# EasyEDA Pro project Twinverter_PB_MTE_3.eprj, schematic PL200_Signals_sch
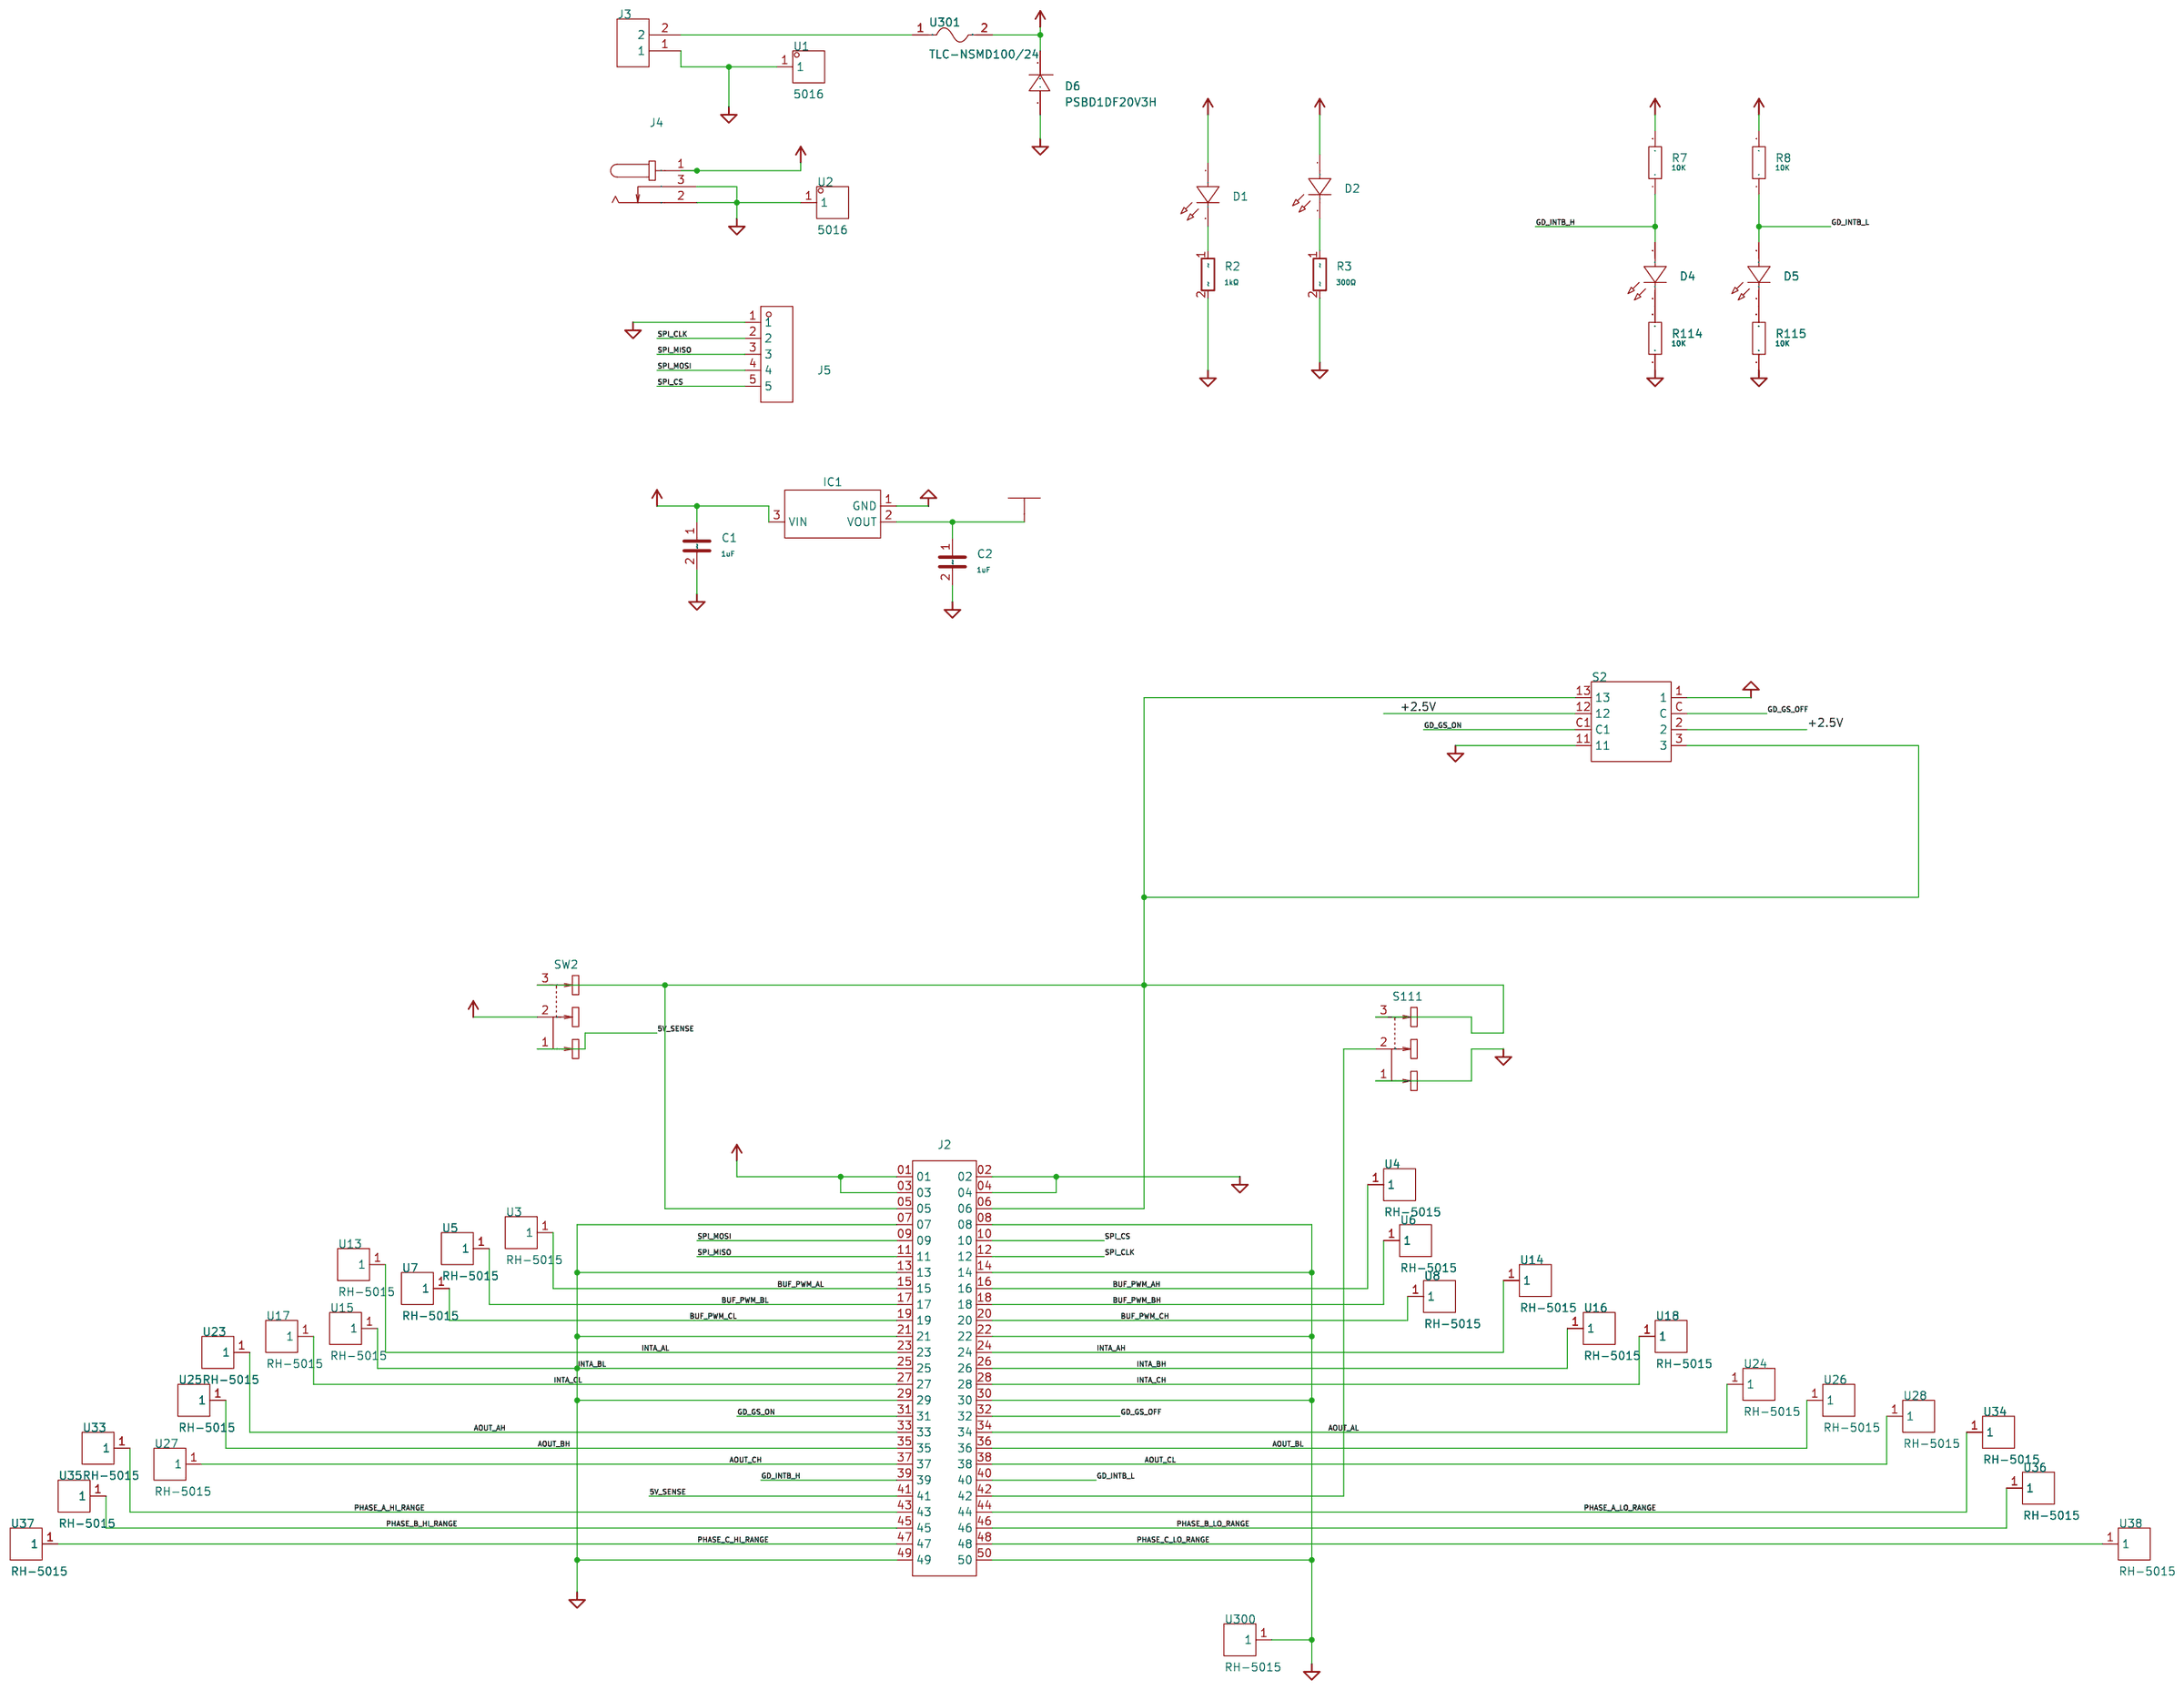
[diagram p2: schematic sheet]

## Parts
C1  1uF  [C1206]
C2  1uF  [C1206]
D1  XL-3216SURC  [LED1206-R-RD_RED]
D2  XL-3216SURC  [LED1206-R-RD_RED]
D4  XL-3216SURC  [LED1206-R-RD_RED]
D5  XL-3216SURC  [LED1206-R-RD_RED]
D6  PSBD1DF20V3H  [SOD-123F_L2.8-W1.8-LS3.7-RD]
IC1  MCP1700T-2502E/TT(MS)  [SOT-23-3_L2.9-W1.3-P1.90-LS2.4-BR]
J2  TFML-125-02-S-D-A  [CONN-SMD_50P-TFML-125-02-S-D-A]
J3  WJ500V-5.08-2P  [CONN-TH_2P-P5.00_WJ500V-5.08-2P]
J4  DC-005-5A-2.0-SMT  [DC-IN-TH_DC-005-5A-2.0-SMT]
J5  WAFER-MX1.25-5PZZ  [CONN-TH_5P-P1.25_XUNPU_WAFER-MX1.25-5PZZ]
R2  1kΩ  [R1206]
R3  300Ω  [R1206]
R7  10K  [Resistor_SMD:R_1206_3216Metric]
R8  10K  [Resistor_SMD:R_1206_3216Metric]
R114  10K  [Resistor_SMD:R_1206_3216Metric]
R115  10K  [Resistor_SMD:R_1206_3216Metric]
S2  SS-10-23NP-E  [SW-TH_8P-L10.0-W10.0-P2.54-S7.6-TR_SS-10-23NP-E]
S111  SS-12D10L5  [SW-TH_SS-12D10L5]
SW2  SS-12D10L5  [SW-TH_SS-12D10L5]
U1  5016  [TEST-SMD_L4.7-P3.4]
U2  5016  [TEST-SMD_L4.7-P3.4]
U3  RH-5015  [SMD_RH-5015]
U4  RH-5015  [SMD_RH-5015]
U5  RH-5015  [SMD_RH-5015]
U6  RH-5015  [SMD_RH-5015]
U7  RH-5015  [SMD_RH-5015]
U8  RH-5015  [SMD_RH-5015]
U13  RH-5015  [SMD_RH-5015]
U14  RH-5015  [SMD_RH-5015]
U15  RH-5015  [SMD_RH-5015]
U16  RH-5015  [SMD_RH-5015]
U17  RH-5015  [SMD_RH-5015]
U18  RH-5015  [SMD_RH-5015]
U23  RH-5015  [SMD_RH-5015]
U24  RH-5015  [SMD_RH-5015]
U25  RH-5015  [SMD_RH-5015]
U26  RH-5015  [SMD_RH-5015]
U27  RH-5015  [SMD_RH-5015]
U28  RH-5015  [SMD_RH-5015]
U33  RH-5015  [SMD_RH-5015]
U34  RH-5015  [SMD_RH-5015]
U35  RH-5015  [SMD_RH-5015]
U36  RH-5015  [SMD_RH-5015]
U37  RH-5015  [SMD_RH-5015]
U38  RH-5015  [SMD_RH-5015]
U300  RH-5015  [SMD_RH-5015]
U301  TLC-NSMD100/24  [F1206]

## Library data of the parts
C1 C2 = CL31B105KBHNNNE: LCSC Part Name: 1uF ±10% 50V; Supplier Part: C1848; Manufacturer: SAMSUNG(三星); Supplier Footprint: 1206; JLCPCB Part Class: Basic Part; Datasheet: https://atta.szlcsc.com/upload/public/pdf/source/20160218/1457707763339.pdf; Supplier: LCSC; Tolerance: ±10%; Voltage Rated: 50V; Temperature Coefficient: X7R
D1 D2 D4 D5 = XL-3216SURC: Supplier Part: C965822; Manufacturer: XINGLIGHT(成兴光); Supplier Footprint: 1206; JLCPCB Part Class: Extended Part; Datasheet: https://atta.szlcsc.com/upload/public/pdf/source/20221102/38B682A5E5FDBBFCA7077B6272CE8E6F.pdf; Supplier: LCSC; Emitted Color: 红色; Power Dissipation: 55mW; Forward Current: 25mA; Dominant Wavelength: 617nm~621nm; Peak Wavelength: 623nm; Lens Color: 无色透明透镜; Viewing Angle: 120°; Mounting Sytle: 正贴; Operating Temperature: -30℃~+85℃
D6 = PSBD1DF20V3H: Supplier Part: C110729; Manufacturer: Prisemi(芯导); Supplier Footprint: SOD-123F; JLCPCB Part Class: Extended Part; Datasheet: https://atta.szlcsc.com/upload/public/pdf/source/20170502/1493709284089.pdf; Supplier: LCSC; Forward Voltage (Vf@If): 550mV@1A; Reverse Voltage (Vr): 20V; Rectified Current: 3A; Reverse Leakage Current (Ir): 500uA@20V; Operating Temperature: -55℃~+150℃@(Tj)
IC1 = MCP1700T-2502E/TT(MS): Supplier Part: C20627191; Manufacturer: MSKSEMI(美森科); Supplier Footprint: SOT-23; JLCPCB Part Class: Extended Part; Datasheet: https://atta.szlcsc.com/upload/public/pdf/source/20240318/6FC6A66C6DA118FF36525C322FF1B1EC.pdf; Supplier: LCSC; Output Type: 固定; Voltage - Supply: 5.5V; Output Voltage: 2.5V; Output Current: 300mA; Voltage Dropout: 230mV@(300mA); standby current: 2uA; Features: 带使能；过热保护；过流保护; Operating Temperature: -40℃~+85℃@(Ta); Output Configuration: 正极; Number of Outputs: 1
J2 = TFML-125-01-S-D-RA: Supplier Part: C17503084; Manufacturer: SAMTEC; Supplier Footprint: 插件; JLCPCB Part Class: Extended Part; Datasheet: https://atta.szlcsc.com/upload/public/pdf/source/231023/C17200826-8fd860b376dc57f4b81139fe7e44d820.pdf; Supplier: LCSC
J3 = WJ500V-5.08-2P: LCSC Part Name: 1x2P 5.08mm 直插 排数:1 每排P数:2; Supplier Part: C8465; Manufacturer: KANGNEX(康奈克斯电气); Supplier Footprint: 插件,P=5.08mm; JLCPCB Part Class: Extended Part; Datasheet: https://atta.szlcsc.com/upload/public/pdf/source/20191225/C8465_02D34CE5B5B4A53DF5891601D97FA9F4.pdf; Supplier: LCSC; Structure: 1x2P; Pitch: 5.08mm; Color: 绿色; Mounting Style: 直插; Current Rating (Max): 18A; Voltage Rating (Max): 250V; Number of Pins: 2P; Number of Rows: 1; Wire Gauge - AWG: 14~30; Wire Gauge - mm2: 2.5; Number of PINs Per Row: 2; Operating Temperature Range: -40℃~+105℃; Screw Specification: M2.5
J4 = DC-005-5A-2.0-SMT: LCSC Part Name: DC电源插座 内径:2mm 外径:6.6mm; Supplier Part: C319134; Manufacturer: XKB Connection(中国星坤); Supplier Footprint: SMD; JLCPCB Part Class: Extended Part; Datasheet: https://atta.szlcsc.com/upload/public/pdf/source/20181029/C319134_3C21841F55E6EB52BBFC76C1BD9D5CFF.pdf; Supplier: LCSC; Connector Type: DC电源插座; Mounting Style: 面板安装; Inside Contact Diameter: 2mm; Outside Contact Diameter: 6.6mm; Current Rating (Max): 2.5A; Voltage Rating (Max): 24V; Operating Temperature Range: -20℃~+70℃
J5 = WAFER-MX1.25-5PZZ: LCSC Part Name: 1x5P 间距:1.25mm 直插 系列:PicoBlade(MX 1.25); Supplier Part: C3029398; Manufacturer: XUNPU(讯普); Supplier Footprint: 插件,P=1.25mm; JLCPCB Part Class: Extended Part; Datasheet: https://atta.szlcsc.com/upload/public/pdf/source/20220527/74EE44A637E2E6AE073051F308D41465.pdf; Supplier: LCSC; Pins Structure: 1x5P; Pitch: 1.25mm; Mounting Type: 直插; Reference Series: PicoBlade(MX 1.25); Number of Pins: 5P; Number of Rows: 1; Number of PINs Per Row: 5; Current Rating: 1A; Contact Material: 黄铜; Operating Temperature: -25℃~+85℃; Voltage Rating: 125V; Plastic Material: LCP; Color: 米色; Z-Height of the Board: 4.6mm; Y-Width of Bottom Edge on Board: 3.3mm
R2 = CRCW12061K00FKEAHP: LCSC Part Name: 厚膜电阻 1kΩ ±1% 750mW; Supplier Part: C844867; Manufacturer: VISHAY(威世); Supplier Footprint: 1206; JLCPCB Part Class: Extended Part; Datasheet: https://atta.szlcsc.com/upload/public/pdf/source/20231213/1BDBFC4CD3780AB0676C2C83B44AD89B.pdf; Supplier: LCSC; Type: 厚膜电阻; Tolerance: ±1%; Power(Watts): 750mW; Temperature Coefficient: ±100ppm/℃; Operating Temperature Range: -55℃~+155℃
R3 = 1206W4F3000T5E: LCSC Part Name: 300Ω ±1% 250mW 厚膜电阻; Supplier Part: C17887; Manufacturer: UNI-ROYAL(厚声); Supplier Footprint: 1206; JLCPCB Part Class: Basic Part; Datasheet: https://atta.szlcsc.com/upload/public/pdf/source/20200306/C422600_1E6D84923E4A46A82E41ADD87F860B5C.pdf; Supplier: LCSC; Type: 厚膜电阻; Tolerance: ±1%; Power(Watts): 250mW; Overload Voltage (Max): 200V; Temperature Coefficient: ±100ppm/℃; Operating Temperature Range: -55℃~+155℃
R7 R8 R114 R115 = Device_R: Resistor; Users: REF**
S2 = SS-10-23NP-E: LCSC Part Name: 旋转选择开关; Supplier Part: C2922052; Manufacturer: NIDEC(尼得科); Supplier Footprint: 插件; JLCPCB Part Class: Extended Part; Datasheet: https://atta.szlcsc.com/upload/public/pdf/source/20220330/8D9D27C146312A91A539362442DC1F6D.pdf; Supplier: LCSC
S111 SW2 = SS-12D10L5: LCSC Part Name: 插件大电流拨动开关; Supplier Part: C319012; Manufacturer: XKB Connectivity(中国星坤); Supplier Footprint: 插件; JLCPCB Part Class: Extended Part; Datasheet: https://atta.szlcsc.com/upload/public/pdf/source/20211009/D6412F37AABE6F9459A6EE7FA4DAEADB.pdf; Supplier: LCSC; Current Rating (DC): 3A; Voltage Rating (DC): 125V; Current Rating (AC): 3A; Voltage Rating (AC): 125V; Circuit: 单刀双掷; Mounting Style: 直插; Mechanical Life: 10000; Actuator Color: 黑色; Actuator Style: 矩形柱状; Pin Style: PC引脚; Operating Temperature: -40℃~+85℃; Switch Length: 13mm; Switch Width: 6.8mm; Switch Height: 6.4mm
U1 U2 = 5016: LCSC Part Name: 测试点/测试环; Supplier Part: C238129; Manufacturer: Keystone; JLCPCB Part Class: Extended Part; Datasheet: https://atta.szlcsc.com/upload/public/pdf/source/20180629/C238129_D9200D88E6E318D7217182519363F103.PDF; Supplier: LCSC; Connector Type: 测试点/测试环
U3-U8 U13-U18 U23-U28 U33-U38 U300 = RH-5015: LCSC Part Name: PCB电路板测试点/测试针; Supplier Part: C5199798; Manufacturer: 荣和; JLCPCB Part Class: Extended Part; Datasheet: https://atta.szlcsc.com/upload/public/pdf/source/20231026/DF0E995FBD7BB891A195515CC364B170.pdf; Supplier: LCSC; Connector Type: 铁环型(贴片); Plastic Color: 无塑胶; Board Space (Diameter φ/ Length x Width): 2.67mmx1.02mm
U301 = TLC-NSMD100/24: LCSC Part Name: 24V 1A 1206自恢复; Supplier Part: C2924939; Manufacturer: TLC(竞沃); Supplier Footprint: 1206; JLCPCB Part Class: Extended Part; Datasheet: https://atta.szlcsc.com/upload/public/pdf/source/20211202/9DD64AE932171F6A930B1738394E7F41.pdf; Supplier: LCSC; Voltage - Max: 24V; Current - Max: 100A; Hold Current: 1A; Trip Current: 2A; Power Dissipation: 600mW; Resistance - Initial (Ri) (Min): 60mΩ; Resistance - Post Trip (R1) (Max): 280mΩ; Time to Trip(Max): 100ms

## Nets
5V_SENSE: J2.41 SW2.1
+2.5V: C2.1 IC1.2(VOUT) S2.2 S2.12
AOUT_AH: J2.33 U23.1
AOUT_AL: J2.34 U24.1
AOUT_BH: J2.35 U25.1
AOUT_BL: J2.36 U26.1
AOUT_CH: J2.37 U27.1
AOUT_CL: J2.38 U28.1
BUF_PWM_AH: J2.16 U4.1
BUF_PWM_AL: J2.15 U3.1
BUF_PWM_BH: J2.18 U6.1
BUF_PWM_BL: J2.17 U5.1
BUF_PWM_CH: J2.20 U8.1
BUF_PWM_CL: J2.19 U7.1
GD_GS_OFF: J2.32 S2.C
GD_GS_ON: J2.31 S2.C1
GD_INTB_H: D4.1(K) J2.39 R7.1
GD_INTB_L: D5.1(K) J2.40 R8.1
INTA_AH: J2.24 U14.1
INTA_AL: J2.23 U13.1
INTA_BH: J2.26 U16.1
INTA_BL: J2.25 U15.1
INTA_CH: J2.28 U18.1
INTA_CL: J2.27 U17.1
PHASE_A_HI_RANGE: J2.43 U33.1
PHASE_A_LO_RANGE: J2.44 U34.1
PHASE_B_HI_RANGE: J2.45 U35.1
PHASE_B_LO_RANGE: J2.46 U36.1
PHASE_C_HI_RANGE: J2.47 U37.1
PHASE_C_LO_RANGE: J2.48 U38.1
POWER_+5VD: C1.1 D2.1(K) IC1.3(VIN) J4.1 R7.2 R8.2 SW2.2
POWER_+12V: D1.1(K) D6.1(K) J2.01 J2.03 U301.2
POWER_GND: C1.2 C2.2 D6.2(A) IC1.1(GND) J2.02 J2.04 J2.07 J2.08 J2.13 J2.14 J2.21 J2.22 J2.29 J2.30 J2.49 J2.50 J3.1 J4.2 J4.3 J5.1 R2.2 R3.2 R114.1 R115.1 S2.1 S2.11 S111.1 U1.1 U2.1 U300.1
SPI_CLK: J2.12 J5.2
SPI_CS: J2.10 J5.5
SPI_MISO: J2.11 J5.3
SPI_MOSI: J2.09 J5.4
Net-(D1-2): D1.2(A) R2.1
Net-(D2-2): D2.2(A) R3.1
Net-(D4-2): D4.2(A) R114.2
Net-(D5-2): D5.2(A) R115.2
Net-(J2-05): J2.05 J2.06 S2.3 S2.13 S111.3 SW2.3
Net-(J2-42): J2.42 S111.2
Net-(J3-2): J3.2 U301.1
